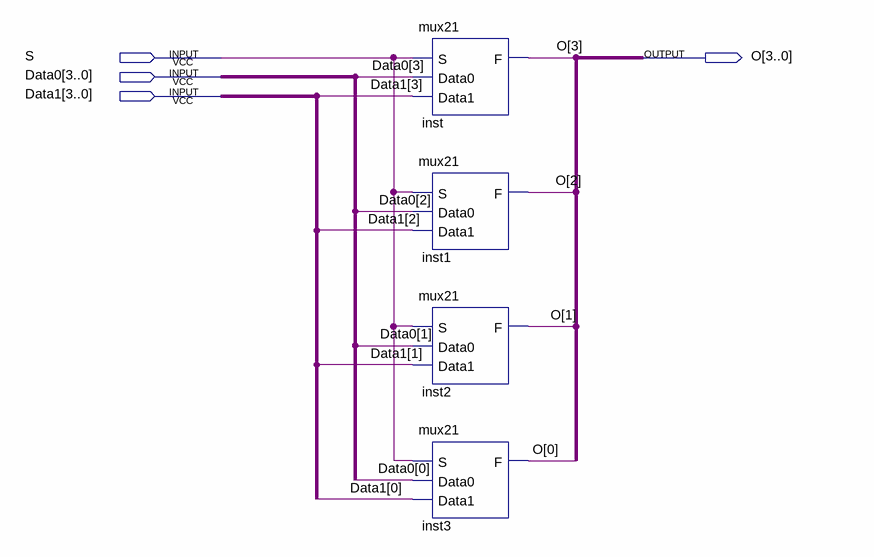
[diagram p0: schematic sheet]
// Quartus schematic mux21_4.bdf as structural Verilog: 4 symbols, 4 pins
module mux21_4 (
  input  S,
  input  [3:0] Data0,
  input  [3:0] Data1,
  output [3:0] O
);

  mux21 inst (.S(S), .Data0(Data0[3]), .Data1(Data1[3]), .F(O[3]));
  mux21 inst1 (.S(S), .Data0(Data0[2]), .Data1(Data1[2]), .F(O[2]));
  mux21 inst2 (.S(S), .Data0(Data0[1]), .Data1(Data1[1]), .F(O[1]));
  mux21 inst3 (.S(S), .Data0(Data0[0]), .Data1(Data1[0]), .F(O[0]));
endmodule
